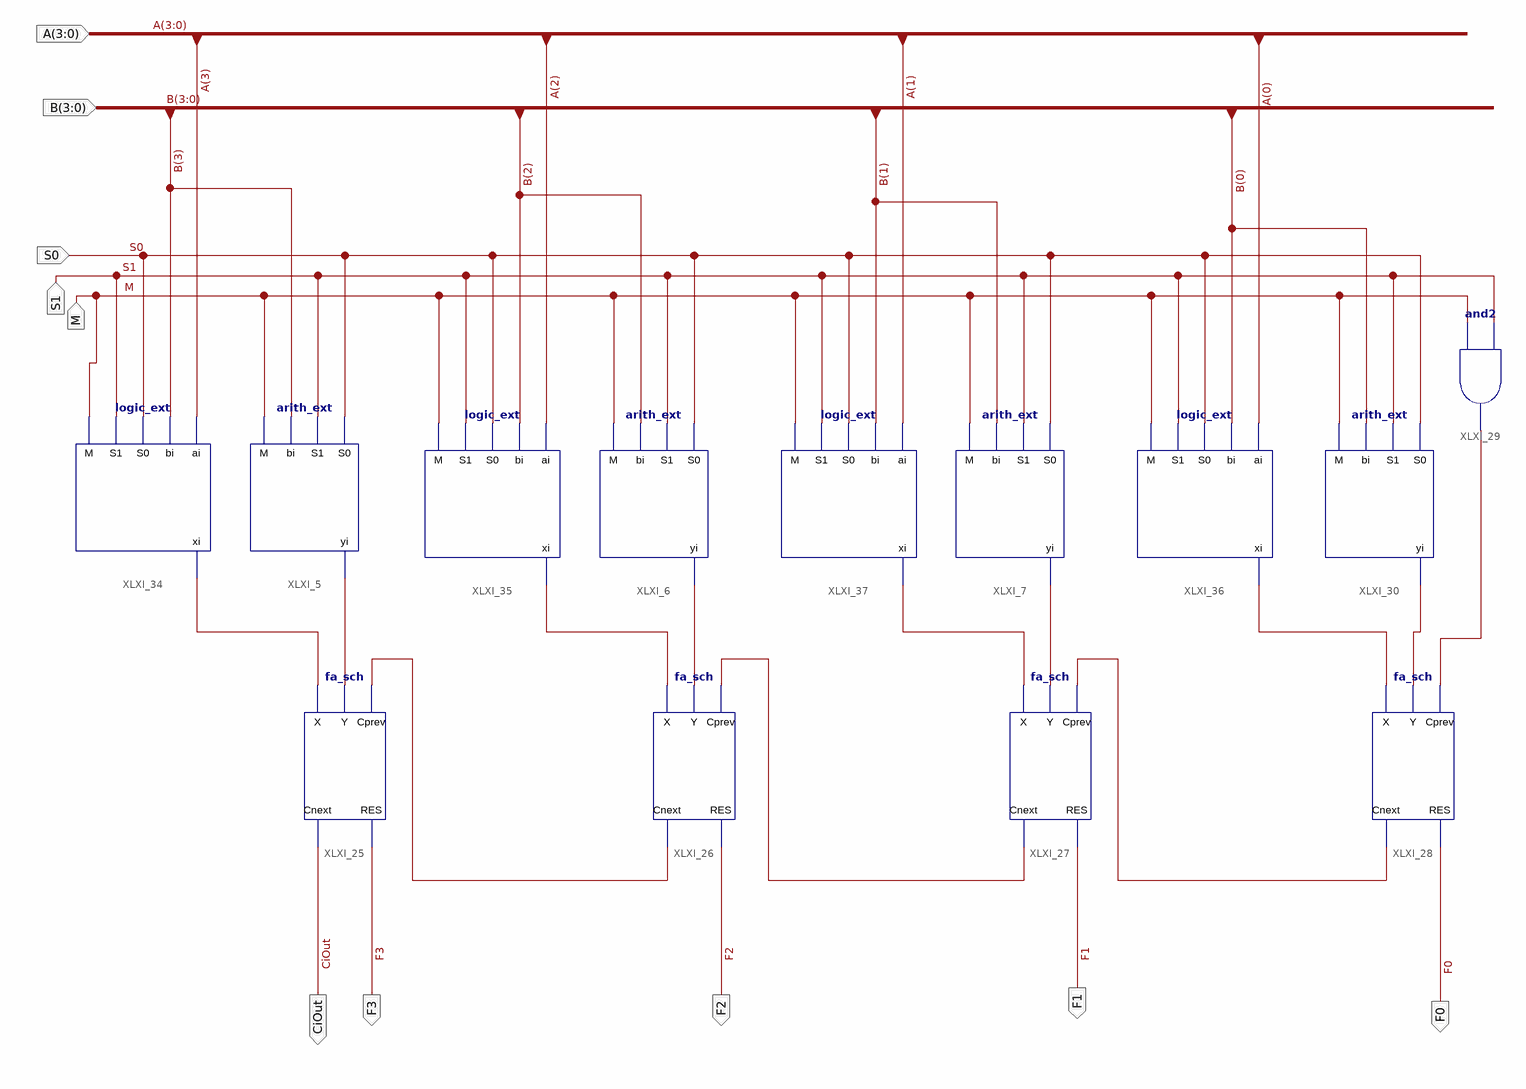
[diagram p0: schematic sheet 1]
// Xilinx ISE schematic alu4bit_sch.sch (spartan3e) as structural Verilog: 13 symbols, 10 ports
module alu4bit_sch (
  input  [3:0] A,
  input  [3:0] B,
  input  S0,
  input  S1,
  input  M,
  output CiOut,
  output F3,
  output F2,
  output F1,
  output F0
);

  wire XLXN_8, XLXN_34, XLXN_35, XLXN_36, XLXN_37, XLXN_38, XLXN_39, XLXN_40, XLXN_41, XLXN_42, XLXN_43,
       XLXN_44;

  arith_ext XLXI_5 (.S0(S0), .S1(S1), .bi(B[3]), .M(M), .yi(XLXN_35));
  arith_ext XLXI_6 (.S0(S0), .S1(S1), .bi(B[2]), .M(M), .yi(XLXN_37));
  arith_ext XLXI_7 (.S0(S0), .S1(S1), .bi(B[1]), .M(M), .yi(XLXN_39));
  fa_sch XLXI_25 (.Cprev(XLXN_42), .Y(XLXN_35), .X(XLXN_34), .RES(F3), .Cnext(CiOut));
  fa_sch XLXI_26 (.Cprev(XLXN_43), .Y(XLXN_37), .X(XLXN_36), .RES(F2), .Cnext(XLXN_42));
  fa_sch XLXI_27 (.Cprev(XLXN_44), .Y(XLXN_39), .X(XLXN_38), .RES(F1), .Cnext(XLXN_43));
  fa_sch XLXI_28 (.Cprev(XLXN_8), .Y(XLXN_41), .X(XLXN_40), .RES(F0), .Cnext(XLXN_44));
  and XLXI_29 (XLXN_8, M, S1);
  arith_ext XLXI_30 (.S0(S0), .S1(S1), .bi(B[0]), .M(M), .yi(XLXN_41));
  logic_ext XLXI_34 (.ai(A[3]), .bi(B[3]), .S0(S0), .S1(S1), .M(M), .xi(XLXN_34));
  logic_ext XLXI_35 (.ai(A[2]), .bi(B[2]), .S0(S0), .S1(S1), .M(M), .xi(XLXN_36));
  logic_ext XLXI_36 (.ai(A[0]), .bi(B[0]), .S0(S0), .S1(S1), .M(M), .xi(XLXN_40));
  logic_ext XLXI_37 (.ai(A[1]), .bi(B[1]), .S0(S0), .S1(S1), .M(M), .xi(XLXN_38));
endmodule
